# Altium schematic sheet JTAG_Configuration.SchDoc
size A4; DocumentNumber: 8; SheetNumber: 8; SheetTotal: 30
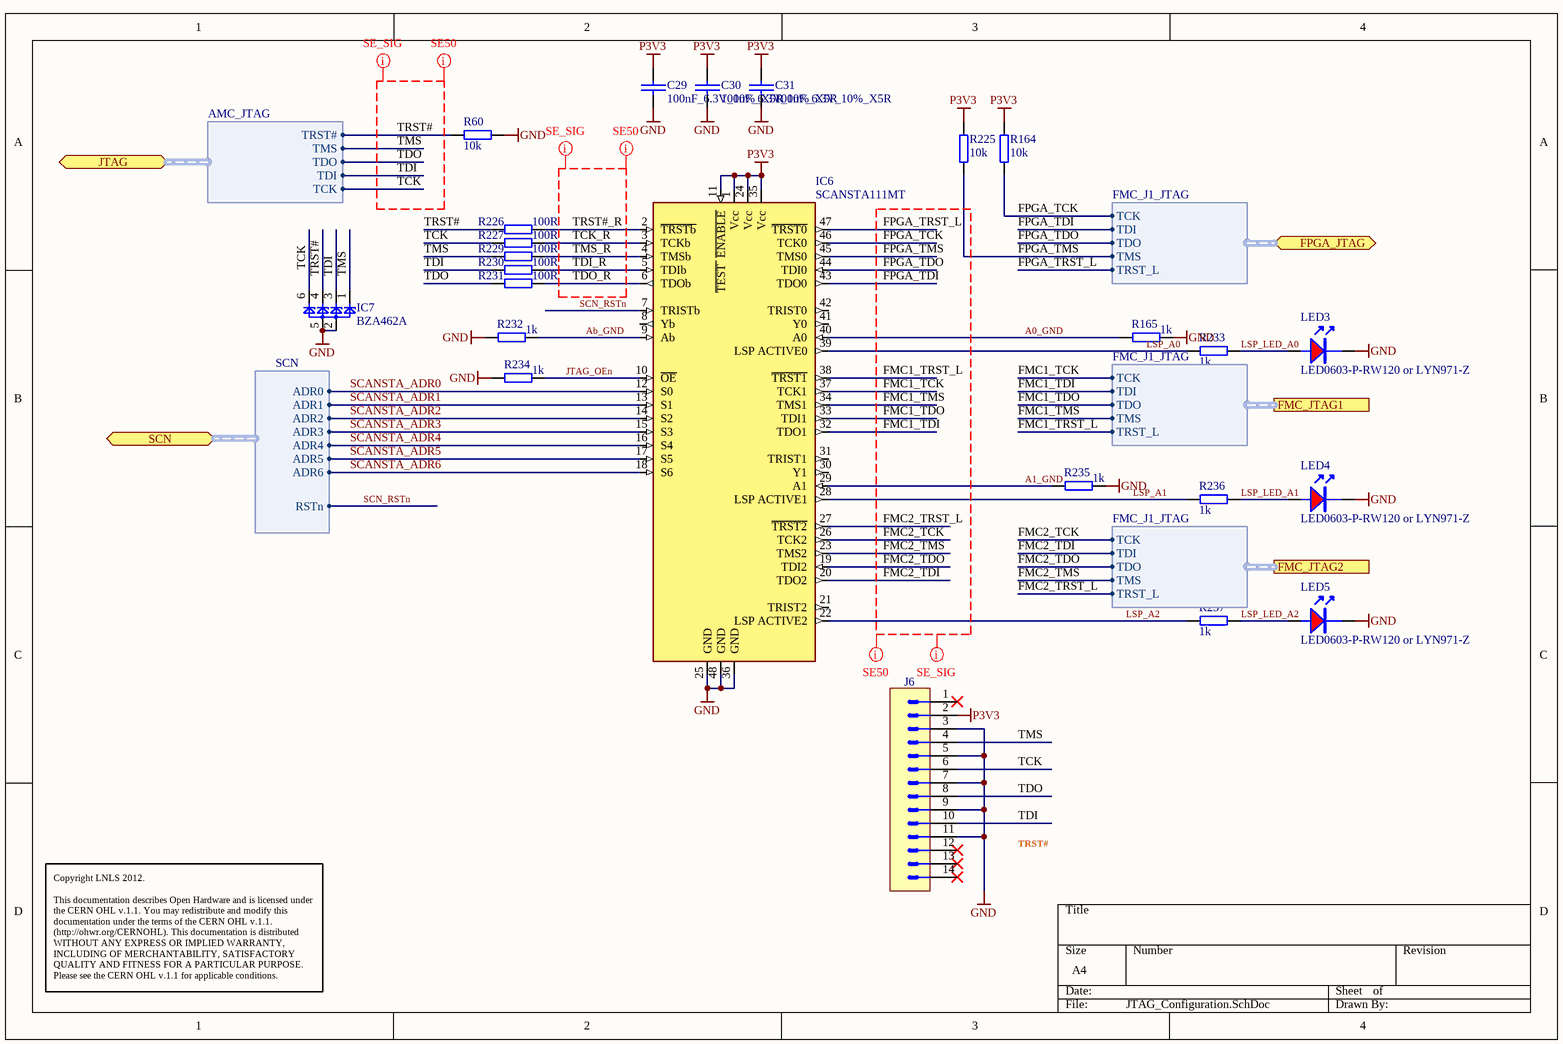
[diagram p0: JTAG_Configuration.SchDoc]

## Parts
C29  100nF_6.3V_10%_X5R  [0201C]
C30  100nF_6.3V_10%_X5R  [0201C]
C31  100nF_6.3V_10%_X5R  [0201C]
IC6  SCANSTA111MT  [TSSOP-48]
IC7  BZA462A  [SOT23-6]
J6  BHMT14S  [BHMT14S]  (value not drawn)
LED3  LED0603-P-RW120 or LYN971-Z  [led_0603R]
LED4  LED0603-P-RW120 or LYN971-Z  [led_0603R]
LED5  LED0603-P-RW120 or LYN971-Z  [led_0603R]
R60  10k  [0402R]
R164  10k  [0402R]
R165  1k  [0402R]
R225  10k  [0402R]
R226  100R  [0402R]
R227  100R  [0402R]
R229  100R  [0402R]
R230  100R  [0402R]
R231  100R  [0402R]
R232  1k  [0402R]
R233  1k  [0402R]
R234  1k  [0402R]
R235  1k  [0402R]
R236  1k  [0402R]
R237  1k  [0402R]

## Ports
FMC_JTAG1 (harness FMC_J1_JTAG), FMC_JTAG2 (harness FMC_J1_JTAG), FPGA_JTAG (harness FMC_J1_JTAG), JTAG (harness AMC_JTAG), SCN (harness SCN)

## Harnesses
FMC_J1_JTAG: TCK, TDI, TDO, TMS, TRST_L
AMC_JTAG: TCK, TDI, TDO, TMS, TRST#
SCN: ADR0, ADR1, ADR2, ADR3, ADR4, ADR5, ADR6, RSTn

## Nets
GND: C29.2 C30.2 C31.2 IC6.25(GND) IC6.36(GND) IC6.48(GND) IC7.2 IC7.5 J6.3 J6.5 J6.7 J6.9 J6.11 LED3.K LED4.K LED5.K R60.1 R165.2 R232.1 R234.1 R235.2
P3V3: C29.1 C30.1 C31.1 IC6.1(Vcc) IC6.11(~{TEST_}_~{ENABLE}) IC6.24(Vcc) IC6.35(Vcc) J6.2 R164.2 R225.2
A0_GND: IC6.40(A0) R165.1
A1_GND: IC6.29(A1) R235.1
Ab_GND: IC6.9(Ab) R232.2
FMC1_TCK: IC6.37(TCK1) ; port FMC_JTAG1.TCK
FMC1_TDI: IC6.32(TDO1) ; port FMC_JTAG1.TDI
FMC1_TDO: IC6.33(TDI1) ; port FMC_JTAG1.TDO
FMC1_TMS: IC6.34(TMS1) ; port FMC_JTAG1.TMS
FMC1_TRST_L: IC6.38(~{TRST1}) ; port FMC_JTAG1.TRST_L
FMC2_TCK: IC6.26(TCK2) ; port FMC_JTAG2.TCK
FMC2_TDI: IC6.20(TDO2) ; port FMC_JTAG2.TDI
FMC2_TDO: IC6.19(TDI2) ; port FMC_JTAG2.TDO
FMC2_TMS: IC6.23(TMS2) ; port FMC_JTAG2.TMS
FMC2_TRST_L: IC6.27(~{TRST2}) ; port FMC_JTAG2.TRST_L
FPGA_TCK: IC6.46(TCK0) R164.1 ; port FPGA_JTAG.TCK
FPGA_TDI: IC6.43(TDO0) ; port FPGA_JTAG.TDI
FPGA_TDO: IC6.44(TDI0) ; port FPGA_JTAG.TDO
FPGA_TMS: IC6.45(TMS0) R225.1 ; port FPGA_JTAG.TMS
FPGA_TRST_L: IC6.47(~{TRST0}) ; port FPGA_JTAG.TRST_L
JTAG_OEn: IC6.10(~{OE}) R234.2
LSP_A0: IC6.39(LSP_ACTIVE0) R233.1
LSP_A1: IC6.28(LSP_ACTIVE1) R236.1
LSP_A2: IC6.22(LSP_ACTIVE2) R237.1
LSP_LED_A0: LED3.A R233.2
LSP_LED_A1: LED4.A R236.2
LSP_LED_A2: LED5.A R237.2
SCANSTA_ADR0: IC6.12(S0) ; port SCN.ADR0
SCANSTA_ADR1: IC6.13(S1) ; port SCN.ADR1
SCANSTA_ADR2: IC6.14(S2) ; port SCN.ADR2
SCANSTA_ADR3: IC6.15(S3) ; port SCN.ADR3
SCANSTA_ADR4: IC6.16(S4) ; port SCN.ADR4
SCANSTA_ADR5: IC6.17(S5) ; port SCN.ADR5
SCANSTA_ADR6: IC6.18(S6) ; port SCN.ADR6
SCN_RSTn: IC6.7(TRISTb) ; port SCN.RSTn
TCK: IC7.6 J6.6 R227.1 ; port JTAG.TCK
TCK_R: IC6.3(TCKb) R227.2
TDI: IC7.3 J6.10 R230.1 ; port JTAG.TDI
TDI_R: IC6.5(TDIb) R230.2
TDO: J6.8 R231.1 ; port JTAG.TDO
TDO_R: IC6.6(TDOb) R231.2
TMS: IC7.1 J6.4 R229.1 ; port JTAG.TMS
TMS_R: IC6.4(TMSb) R229.2
TRST#: IC7.4 R60.2 R226.1 ; port JTAG.TRST#
TRST#_R: IC6.2(~{TRSTb}) R226.2

Not connected (* = marked no-connect by the designer): IC6 8(Yb) 21(TRIST2) 30(Y1) 31(TRIST1) 41(Y0) 42(TRIST0); J6 1* 12* 13* 14*

## Layout directives
net class SE_SIG: FMC1_TCK, FMC1_TDI, FMC1_TDO, FMC1_TMS, FMC1_TRST_L, FMC2_TCK, FMC2_TDI, FMC2_TDO, FMC2_TMS, FMC2_TRST_L, FPGA_TCK, FPGA_TDI, FPGA_TDO, FPGA_TMS, FPGA_TRST_L, TCK, TCK_R, TDI, TDI_R, TDO, TDO_R, TMS, TMS_R, TRST#, TRST#_R
net class SE50: FMC1_TCK, FMC1_TDI, FMC1_TDO, FMC1_TMS, FMC1_TRST_L, FMC2_TCK, FMC2_TDI, FMC2_TDO, FMC2_TMS, FMC2_TRST_L, FPGA_TCK, FPGA_TDI, FPGA_TDO, FPGA_TMS, FPGA_TRST_L, TCK, TCK_R, TDI, TDI_R, TDO, TDO_R, TMS, TMS_R, TRST#, TRST#_R

## Notes on the sheet
- TRST#
- Copyright LNLS 2012.
  This documentation describes Open Hardware and is licensed under the CERN OHL v.1.1. You may redistribute and modify this documentation under the terms of the CERN OHL v.1.1. (http://ohwr.org/CERNOHL). This documentation is distributed WITHOUT ANY EXPRESS OR IMPLIED WARRANTY, INCLUDING OF MERCHANTABILITY, SATISFACTORY QUALITY AND FITNESS FOR A PARTICULAR PURPOSE. Please see the CERN OHL v.1.1 for applicable conditions.

## Library data of the parts
C29-C31 = CAP_SMD_0201: Capacitor SMD
IC6 = IFC_SCANSTA111: Enhanced SCAN Bridge Multidrop Addressable IEEE 1149.1 (JTAG) Port; Supplier 1: Digi-Key; Supplier Part Number 1: SCANSTA111MT-ND
IC7 = D_TVS_BZA462A: Quadruple 4V ESD transient voltage suppressor; Supplier 1: Newark; Supplier Part Number 1: 79R1868
J6 = MOLEX_87831-1420: Connector 14 Male; Part Description: 2.00mm (.079") Pitch Milli-Grid™ Header, Vertical, Shrouded, Center Polarization Slot, Locking Window, 14 Circuits; Part Number: BHMT14S; Component Kind: Standard; Component Type: Standard; Pin Count: 14; Family: Milli-Grid™; Mounted: Yes; Socket: No; SMD: No; Status: None; Manufacturer Part Number: BHMT14S; ComponentHeight: 6.4mm; Author: CERN DEM JLC; CreateDate: 2010-04-13; LatestRevisionDate: 2010-04-13
LED3-LED5 = LED_0603R: LED 0603 red; Supplier 1: Newark; Supplier Part Number 1: 22M3004
R60 R164 R165 R225-R227 R229-R237 = RES_0402: SMD Resistor; Supplier 1: Newark; Supplier Part Number 1: 59M6691